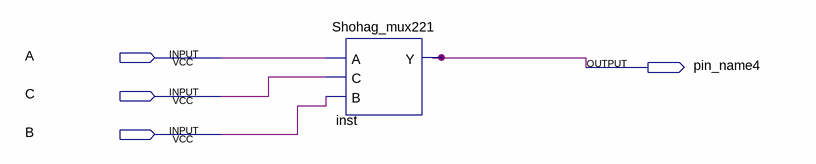
[diagram p0: schematic sheet]
// Quartus schematic Shohag_symbol_mux21.bdf as structural Verilog: 1 symbols, 4 pins
module Shohag_symbol_mux21 (
  input  A,
  input  C,
  input  B,
  output pin_name4
);

  Shohag_mux221 inst (.A(A), .C(C), .B(B), .Y(pin_name4));
endmodule
